# EAGLE schematic M8830C (EAGLE 6.6.0)
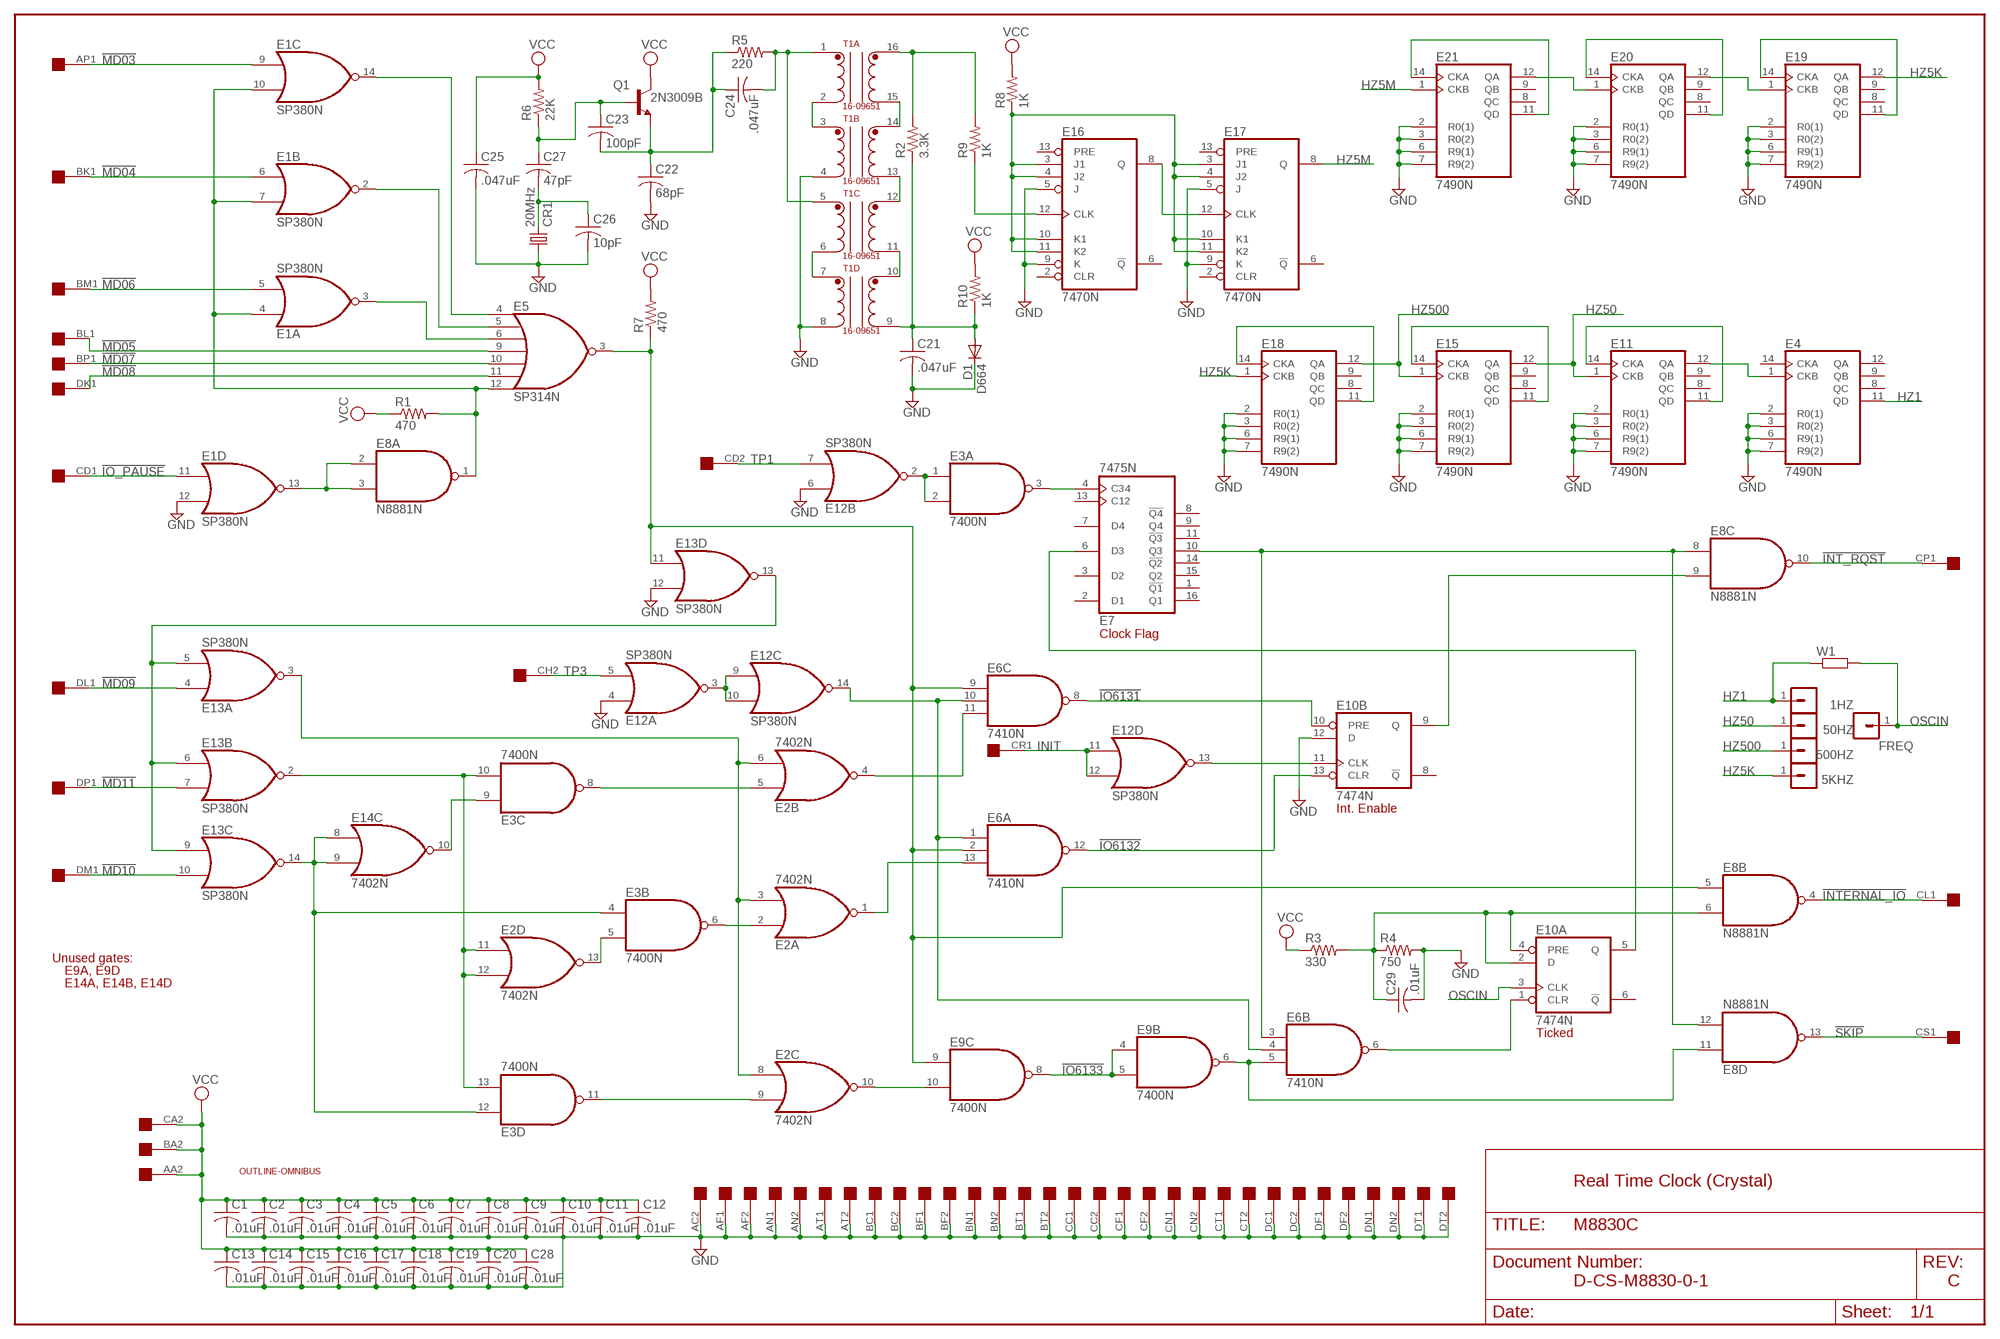
[diagram p0: schematic, sheet 1]

## Parts
1HZ  MA01-1  [MA01-1]
5KHZ  MA01-1  [MA01-1]
50HZ  MA01-1  [MA01-1]
500HZ  MA01-1  [MA01-1]
C1  .01uF  C-US050-025X075  [C050-025X075]
C2  .01uF  C-US050-025X075  [C050-025X075]
C3  .01uF  C-US050-025X075  [C050-025X075]
C4  .01uF  C-US050-025X075  [C050-025X075]
C5  .01uF  C-US050-025X075  [C050-025X075]
C6  .01uF  C-US050-025X075  [C050-025X075]
C7  .01uF  C-US050-025X075  [C050-025X075]
C8  .01uF  C-US050-025X075  [C050-025X075]
C9  .01uF  C-US050-025X075  [C050-025X075]
C10  .01uF  C-US050-025X075  [C050-025X075]
C11  .01uF  C-US050-025X075  [C050-025X075]
C12  .01uF  C-US050-025X075  [C050-025X075]
C13  .01uF  C-US050-025X075  [C050-025X075]
C14  .01uF  C-US050-025X075  [C050-025X075]
C15  .01uF  C-US050-025X075  [C050-025X075]
C16  .01uF  C-US050-025X075  [C050-025X075]
C17  .01uF  C-US050-025X075  [C050-025X075]
C18  .01uF  C-US050-025X075  [C050-025X075]
C19  .01uF  C-US050-025X075  [C050-025X075]
C20  .01uF  C-US050-025X075  [C050-025X075]
C21  .047uF  C-US050-025X075  [C050-025X075]
C22  68pF  C-US050-025X075  [C050-025X075]
C23  100pF  C-US050-025X075  [C050-025X075]
C24  .047uF  C-US050-025X075  [C050-025X075]
C25  .047uF  C-US050-025X075  [C050-025X075]
C26  10pF  C-US050-025X075  [C050-025X075]
C27  47pF  C-US050-025X075  [C050-025X075]
C28  .01uF  C-US050-025X075  [C050-025X075]
C29  .01uF  C-US050-025X075  [C050-025X075]
CR1  20MHz  CRYSTALHC49TL-H  [HC49TL-H]
D1  D664  DIODE-DO35-10  [DO35-10]
E1  SP380N  [DIL14]
E2  7402N  [DIL14]
E3  7400N  [DIL14]
E4  7490N  [DIL14]
E5  SP314N  [DIL14]
E6  7410N  [DIL14]
E7  7475N  [DIL16]
E8  N8881N  [DIL14]
E9  7400N  [DIL14]
E10  7474N  74S74N  [DIL14]
E11  7490N  [DIL14]
E12  SP380N  [DIL14]
E13  SP380N  [DIL14]
E14  7402N  [DIL14]
E15  7490N  [DIL14]
E16  7470N  [DIL14]
E17  7470N  [DIL14]
E18  7490N  [DIL14]
E19  7490N  [DIL14]
E20  7490N  [DIL14]
E21  7490N  [DIL14]
EDGE  QUAD  [EDGE-CON8]
FREQ  MA01-1  [MA01-1]
Q1  2N3009B  -NPN-TO5  [TO5]
R1  470  R-US_0207/10  [0207/10]
R2  3.3K  R-US_0207/10  [0207/10]
R3  330  R-US_0207/10  [0207/10]
R4  750  R-US_0207/10  [0207/10]
R5  220  R-US_0207/10  [0207/10]
R6  22K  R-US_0207/10  [0207/10]
R7  470  R-US_0207/10  [0207/10]
R8  1K  R-US_0207/10  [0207/10]
R9  1K  R-US_0207/10  [0207/10]
R10  1K  R-US_0207/10  [0207/10]
T1  16-09651  [DIL16]
U$1  OUTLINE-OMNIBUS  [OMNIBUS]
W1  R-EU_0207/10  [0207/10]

## Nets
!BIOPAUSE: E1.4(A:I0) E1.7(B:I1) E1.10(C:I1) E5.12(I6) E8.1(A:O) R1.2
!DO_CLSK: E6.6(B:O) E10.1(A:CLR)
!INIT: E10.11(B:CLK) E12.13(D:O)
!INT_RQST: E8.10(C:O) EDGE.CP1
!INTERNAL_IO: E8.4(B:O) EDGE.CL1
!IO6131: E6.8(C:O) E10.10(B:PRE)
!IO6132: E6.12(A:O) E10.13(B:CLR)
!IO6133: E9.4(B:I0) E9.5(B:I1) E9.8(C:O)
!IO_PAUSE: E1.11(D:I0) EDGE.CD1
!MAYBE_CLEI: E2.5(B:I0) E3.8(C:O)
!MAYBE_CLSK: E2.9(C:I1) E3.11(D:O)
!MAYBECLDI: E2.2(A:I0) E3.6(B:O)
!MD03: E1.9(C:I0) EDGE.AP1
!MD04: E1.6(B:I0) EDGE.BK1
!MD05: E5.9(I3) EDGE.BL1
!MD06: E1.5(A:I1) EDGE.BM1
!MD07: E5.10(I4) EDGE.BP1
!MD08: E5.11(I5) EDGE.DK1
!MD09: E13.4(A:I0) EDGE.DL1
!MD10: E13.10(C:I1) EDGE.DM1
!MD11: E13.7(B:I1) EDGE.DP1
!MYIOT: E13.5(A:I1) E13.6(B:I0) E13.9(C:I0) E13.13(D:O)
!MYMD10: E3.9(C:I0) E14.10(C:O)
!MYMD11: E2.13(D:O) E3.5(B:I1)
!SKIP: E8.13(D:O) EDGE.CS1
!TP1: E3.1(A:I0) E3.2(A:I1) E12.2(B:O)
!TP3: E12.3(A:O) E12.9(C:I0) E12.10(C:I1)
+3V3: C29.1 E8.6(B:I1) E10.2(A:D) E10.4(A:PRE) R3.2 R4.1
BTP1: E3.3(A:O) E7.4(C34)
BTP3: E6.1(A:I0) E6.4(B:I1) E6.10(C:I1) E12.14(C:O)
CK_FLAG: E6.3(B:I0) E7.10(Q3) E8.8(C:I0) E8.12(D:I1)
CLDI: E2.1(A:O) E6.13(A:I2)
CLIE: E2.4(B:O) E6.11(C:I2)
CLSK: E2.10(C:O) E9.10(C:I1)
GND: C1.2 C2.2 C3.2 C4.2 C5.2 C6.2 C7.2 C8.2 C9.2 C10.2 C11.2 C12.2 C13.2 C14.2 C15.2 C16.2 C17.2 C18.2 C19.2 C20.2 C21.2 C22.2 C25.2 C26.2 C28.2 C29.2 CR1.1 D1.C E1.12(D:I1) E4.2(R0(1)) E4.3(R0(2)) E4.6(R9(1)) E4.7(R9(2)) E10.12(B:D) E11.2(R0(1)) E11.3(R0(2)) E11.6(R9(1)) E11.7(R9(2)) E12.4(A:I0) E12.6(B:I0) E13.12(D:I1) E15.2(R0(1)) E15.3(R0(2)) E15.6(R9(1)) E15.7(R9(2)) E16.5(J) E16.9(K) E17.5(J) E17.9(K) E18.2(R0(1)) E18.3(R0(2)) E18.6(R9(1)) E18.7(R9(2)) E19.2(R0(1)) E19.3(R0(2)) E19.6(R9(1)) E19.7(R9(2)) E20.2(R0(1)) E20.3(R0(2)) E20.6(R9(1)) E20.7(R9(2)) E21.2(R0(1)) E21.3(R0(2)) E21.6(R9(1)) E21.7(R9(2)) EDGE.AC2 EDGE.AF1 EDGE.AF2 EDGE.AN1 EDGE.AN2 EDGE.AT1 EDGE.AT2 EDGE.BC1 EDGE.BC2 EDGE.BF1 EDGE.BF2 EDGE.BN1 EDGE.BN2 EDGE.BT1 EDGE.BT2 EDGE.CC1 EDGE.CC2 EDGE.CF1 EDGE.CF2 EDGE.CN1 EDGE.CN2 EDGE.CT1 EDGE.CT2 EDGE.DC1 EDGE.DC2 EDGE.DF1 EDGE.DF2 EDGE.DN1 EDGE.DN2 EDGE.DT1 EDGE.DT2 R4.2 T1.4 T1.8
HZ1: 1HZ.1 E4.11(QD) W1.1
HZ5: E4.1(CKB) E11.12(QA)
HZ5K: 5KHZ.1 E18.1(CKB) E19.12(QA)
HZ5M: E17.8(Q) E21.1(CKB)
HZ10M: E16.8(Q) E17.12(CLK)
HZ50: 50HZ.1 E11.1(CKB) E15.12(QA)
HZ50K: E19.1(CKB) E20.12(QA)
HZ500: 500HZ.1 E15.1(CKB) E18.12(QA)
HZ500K: E20.1(CKB) E21.12(QA)
INIT: E12.11(D:I0) E12.12(D:I1) EDGE.CR1
IO6133: E6.5(B:I2) E8.11(D:I0) E9.6(B:O)
IO_PAUSE: E1.13(D:O) E8.2(A:I0) E8.3(A:I1)
IOPMD03: E1.14(C:O) E5.4(I0)
IOPMD04: E1.2(B:O) E5.5(I1)
IOPMD06: E1.3(A:O) E5.6(I2)
IRQ_ENABLE: E8.9(C:I1) E10.9(B:Q)
MYIOT: E5.3(O) E6.2(A:I1) E6.9(C:I0) E8.5(B:I0) E9.9(C:I0) E13.11(D:I0) R7.1
MYMD09: E2.3(A:I1) E2.6(B:I1) E2.8(C:I0) E13.3(A:O)
MYMD10: E3.4(B:I0) E3.12(D:I0) E13.14(C:O) E14.8(C:I0) E14.9(C:I1)
MYMD11: E2.11(D:I0) E2.12(D:I1) E3.10(C:I1) E3.13(D:I1) E13.2(B:O)
N$4: T1.2 T1.3
N$5: T1.14 T1.15
N$7: E11.11(QD) E11.14(CKA)
N$8: E15.11(QD) E15.14(CKA)
N$9: E18.11(QD) E18.14(CKA)
N$10: E19.11(QD) E19.14(CKA)
N$11: E20.11(QD) E20.14(CKA)
N$12: E21.11(QD) E21.14(CKA)
N$13: E16.3(J1) E16.4(J2) E16.10(K1) E16.11(K2) E17.3(J1) E17.4(J2) E17.10(K1) E17.11(K2) R8.1
N$14: T1.12 T1.13
N$15: R2.2 R9.2 T1.16
N$16: T1.6 T1.7
N$17: T1.10 T1.11
N$18: C21.1 D1.A R2.1 R10.1 T1.9
N$19: E16.12(CLK) R9.1
N$20: C23.1 C27.1 Q1.2(B) R6.1
N$21: C26.1 C27.2 CR1.2
N$22: C22.1 C23.2 C24.1 Q1.1(E) R5.1
N$23: C24.2 R5.2 T1.1 T1.5
OSCIN: E10.3(A:CLK) FREQ.1 W1.2
TICKED: E7.6(D3) E10.5(A:Q)
TP1: E12.7(B:I1) EDGE.CD2
TP3: E12.5(A:I1) EDGE.CH2
VCC: C1.1 C2.1 C3.1 C4.1 C5.1 C6.1 C7.1 C8.1 C9.1 C10.1 C11.1 C12.1 C13.1 C14.1 C15.1 C16.1 C17.1 C18.1 C19.1 C20.1 C25.1 C28.1 EDGE.AA2 EDGE.BA2 EDGE.CA2 Q1.3(C) R1.1 R3.1 R6.2 R7.2 R8.2 R10.2
Unconnected: E4.8(QC) E4.9(QB) E4.12(QA) E4.14(CKA) E7.1(!Q1) E7.2(D1) E7.3(D2) E7.7(D4) E7.8(!Q4) E7.9(Q4) E7.11(!Q3) E7.13(C12) E7.14(!Q2) E7.15(Q2) E7.16(Q1) E9.1(A:I0) E9.2(A:I1) E9.3(A:O) E9.11(D:O) E9.12(D:I0) E9.13(D:I1) E10.6(A:!Q) E10.8(B:!Q) E11.8(QC) E11.9(QB) E14.1(A:O) E14.2(A:I0) E14.3(A:I1) E14.4(B:O) E14.5(B:I0) E14.6(B:I1) E14.11(D:I0) E14.12(D:I1) E14.13(D:O) E15.8(QC) E15.9(QB) E16.2(CLR) E16.6(!Q) E16.13(PRE) E17.2(CLR) E17.6(!Q) E17.13(PRE) E18.8(QC) E18.9(QB) E19.8(QC) E19.9(QB) E20.8(QC) E20.9(QB) E21.8(QC) E21.9(QB) EDGE.AA1 EDGE.AB1 EDGE.AB2 EDGE.AC1 EDGE.AD1 EDGE.AD2 EDGE.AE1 EDGE.AE2 EDGE.AH1 EDGE.AH2 EDGE.AJ1 EDGE.AJ2 EDGE.AK1 EDGE.AK2 EDGE.AL1 EDGE.AL2 EDGE.AM1 EDGE.AM2 EDGE.AP2 EDGE.AR1 EDGE.AR2 EDGE.AS1 EDGE.AS2 EDGE.AU1 EDGE.AU2 EDGE.AV1 EDGE.AV2 EDGE.BA1 EDGE.BB1 EDGE.BB2 EDGE.BD1 EDGE.BD2 EDGE.BE1 EDGE.BE2 EDGE.BH1 EDGE.BH2 EDGE.BJ1 EDGE.BJ2 EDGE.BK2 EDGE.BL2 EDGE.BM2 EDGE.BP2 EDGE.BR1 EDGE.BR2 EDGE.BS1 EDGE.BS2 EDGE.BU1 EDGE.BU2 EDGE.BV1 EDGE.BV2 EDGE.CA1 EDGE.CB1 EDGE.CB2 EDGE.CE1 EDGE.CE2 EDGE.CH1 EDGE.CJ1 EDGE.CJ2 EDGE.CK1 EDGE.CK2 EDGE.CL2 EDGE.CM1 EDGE.CM2 EDGE.CP2 EDGE.CR2 EDGE.CS2 EDGE.CU1 EDGE.CU2 EDGE.CV1 EDGE.CV2 EDGE.DA1 EDGE.DA2 EDGE.DB1 EDGE.DB2 EDGE.DD1 EDGE.DD2 EDGE.DE1 EDGE.DE2 EDGE.DH1 EDGE.DH2 EDGE.DJ1 EDGE.DJ2 EDGE.DK2 EDGE.DL2 EDGE.DM2 EDGE.DP2 EDGE.DR1 EDGE.DR2 EDGE.DS1 EDGE.DS2 EDGE.DU1 EDGE.DU2 EDGE.DV1 EDGE.DV2

## Notes on the sheet
- Clock Flag
- Int. Enable
- Unused gates:
- E9A, E9D
- E14A, E14B, E14D
- Ticked
- Real Time Clock (Crystal)
- D-CS-M8830-0-1 | C

## Power pins joined to a net without a drawn wire
GND: E1.1(P:GND) E2.7(P:GND) E3.7(P:GND) E4.10(GND) E5.1(GND) E6.7(P:GND) E7.12(GND) E8.7(P:GND) E9.7(P:GND) E10.7(P:GND) E11.10(GND) E12.1(P:GND) E13.1(P:GND) E14.7(P:GND) E15.10(GND) E16.7(GND) E17.7(GND) E18.10(GND) E19.10(GND) E20.10(GND) E21.10(GND)
VCC: E1.8(P:VCC) E2.14(P:VCC) E3.14(P:VCC) E4.5(VCC) E5.8(VCC) E6.14(P:VCC) E7.5(VCC) E8.14(P:VCC) E9.14(P:VCC) E10.14(P:VCC) E11.5(VCC) E12.8(P:VCC) E13.8(P:VCC) E14.14(P:VCC) E15.5(VCC) E16.14(VCC) E17.14(VCC) E18.5(VCC) E19.5(VCC) E20.5(VCC) E21.5(VCC)

## Library data of the parts
1HZ 5KHZ 50HZ 500HZ FREQ = dec-con:MA01-1: Pin Header (.125" spacing)
C1-C29 = rcl:C-US: CAPACITOR, American symbol
CR1 = crystal:CRYSTAL: CRYSTAL; OC_FARNELL: unknown; OC_NEWARK: unknown
D1 = diode:DIODE-: DIODE
E1 E12 E13 = dec-con:SP380: Quad NOR gate (use 8640)
E2 E14 = 74xx-us:74*02: Quad 2-input NOR gate
E3 E9 = 74xx-us:74*00: Quad 2-input NAND gate
E4 E11 E15 E18-E21 = 74xx-us:74*90: Decade, divide by twelve and binary COUNTER
E5 = dec-con:SP314: 7-Input NOR gate
E6 = 74xx-us:74*10: Triple 3-input NAND gate
E7 = 74xx-us:74*75: 4-bit bistable LATCH
E8 = dec-con:N8881: Quad 2-input NAND gate, open collector
E10 = 74xx-us:74*74: Dual D type positive edge triggered FLIP FLOP, preset and clear
E16 E17 = 74xx-us:74*70: AND gated J-K positive edge triggered FLIP FLOP, preset and clear
EDGE = dec-con:QUAD: Quad-Height DEC board
Q1 = transistor:*-NPN-: NPN Transistror BF959 corrected 2008.03.06
R1-R10 = rcl:R-US_: RESISTOR, American symbol
T1 = dec-con:16-09651: DIP-16 Quad Pulse Transformer
U$1 = dec-con:OUTLINE-*: Board outlines for DEC boards.
W1 = rcl:R-EU_: RESISTOR, European symbol

## Net classes
0 default: width 0.813 mm